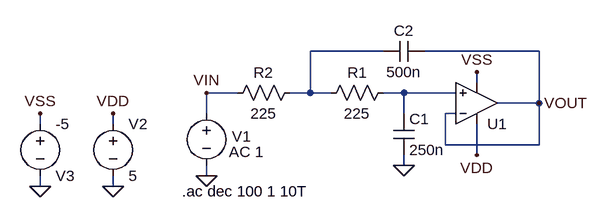
[diagram p0: schematic Sallen_Key_LPF.asc]
Sallen_Key_LPF.asc, the LTspice schematic file:
Version 4
SHEET 1 880 680
WIRE 96 96 -16 96
WIRE 336 96 160 96
WIRE 240 144 240 128
WIRE -128 160 -176 160
WIRE -16 160 -16 96
WIRE -16 160 -48 160
WIRE 16 160 -16 160
WIRE 128 160 96 160
WIRE 208 160 128 160
WIRE 336 176 336 96
WIRE 336 176 272 176
WIRE -176 192 -176 160
WIRE 128 192 128 160
WIRE 208 192 192 192
WIRE -432 208 -432 192
WIRE -320 208 -320 192
WIRE 192 240 192 192
WIRE 336 240 336 176
WIRE 336 240 192 240
WIRE 240 256 240 208
WIRE 128 272 128 256
WIRE -176 288 -176 272
WIRE -432 304 -432 288
WIRE -320 304 -320 288
FLAG 128 272 0
FLAG -176 288 0
FLAG -176 160 VIN
FLAG 336 176 VOUT
FLAG 240 256 VDD
FLAG 240 128 VSS
FLAG -320 192 VDD
FLAG -320 304 0
FLAG -432 304 0
FLAG -432 192 VSS
SYMBOL res 112 144 R90
WINDOW 0 0 56 VBottom 2
WINDOW 3 32 56 VTop 2
SYMATTR InstName R1
SYMATTR Value 225
SYMBOL res -32 144 R90
WINDOW 0 0 56 VBottom 2
WINDOW 3 32 56 VTop 2
SYMATTR InstName R2
SYMATTR Value 225
SYMBOL cap 160 80 R90
WINDOW 0 0 32 VBottom 2
WINDOW 3 32 32 VTop 2
SYMATTR InstName C2
SYMATTR Value 500n
SYMBOL cap 112 192 R0
SYMATTR InstName C1
SYMATTR Value 250n
SYMBOL voltage -176 176 R0
WINDOW 0 39 51 Left 2
WINDOW 3 24 44 Left 2
WINDOW 123 35 75 Left 2
WINDOW 39 0 0 Left 0
SYMATTR InstName V1
SYMATTR Value ""
SYMATTR Value2 AC 1
SYMBOL voltage -320 192 R0
WINDOW 123 0 0 Left 0
WINDOW 39 0 0 Left 0
SYMATTR InstName V2
SYMATTR Value 5
SYMBOL voltage -432 192 R0
WINDOW 0 24 96 Left 2
WINDOW 3 24 16 Left 2
WINDOW 123 0 0 Left 0
WINDOW 39 0 0 Left 0
SYMATTR InstName V3
SYMATTR Value -5
SYMBOL OpAmps\\UniversalOpamp2 240 176 M180
SYMATTR InstName U1
TEXT -214 312 Left 2 !.ac dec 100 1 10T

The netlist it stands for:
* Sallen_Key_LPF.asc
R1 N002 N001 225
R2 N001 VIN 225
C2 VOUT N001 500n
C1 N002 0 250n
V1 VIN 0 AC 1
V2 VDD 0 5
V3 VSS 0 -5
XU1 N002 VOUT VDD VSS VOUT level.2 Avol=1Meg GBW=10Meg Slew=10Meg ilimit=25m rail=0 Vos=0 phimargin=45 en=0 enk=0 in=0 ink=0 Rin=500Meg  ; pins IN+ IN- V+ V- OUT
.ac dec 100 1 10T
.lib UniversalOpamps2.sub
.backanno
.end